# EAGLE design TinyFunctionGenerator (EAGLE 7.6.0)
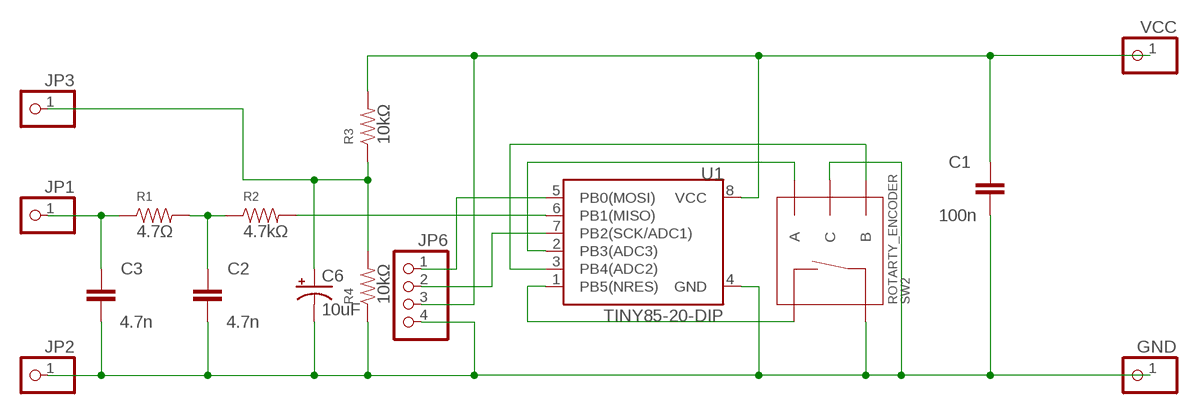
[diagram p0: schematic, sheet 1]

## Parts
C1  100n  CAP_  [AXIAL-5MM]
C2  4.7n  CAPPTH  [CAP-PTH-SMALL]
C3  4.7n  CAPPTH  [CAP-PTH-SMALL]
C6  10uF  10UF-25V-20%(PTH)  [CPOL-RADIAL-10UF-25V]
GND  PINHD-1X1CB  [1X01-CLEANBIG]
JP1  PINHD-1X1CB  [1X01-CLEANBIG]
JP2  PINHD-1X1CB  [1X01-CLEANBIG]
JP3  PINHD-1X1CB  [1X01-CLEANBIG]
JP6  HEADER-1X4ROUND  [1X04_ROUND]
R1  4.7Ω  RESISTORPTH-1/4W  [AXIAL-0.4]
R2  4.7kΩ  RESISTORPTH-1/4W  [AXIAL-0.4]
R3  10kΩ  RESISTORPTH-1/4W  [AXIAL-0.4]
R4  10kΩ  RESISTORPTH-1/4W  [AXIAL-0.4]
SW2  ROTARTY_ENCODER  [ROTARY_ENC_PLAIN]
U1  TINY85-20-DIP  ATTINY45TINY85-20-DIP  [DIP08]
VCC  PINHD-1X1CB  [1X01-CLEANBIG]

## Nets
GND: C1.P$2 C2.2 C3.2 C6.2(-) GND.1 JP2.1 JP6.4 R4.P$1 SW2.C SW2.SW+ U1.4(GND)
N$1: JP6.2 U1.7(PB2(SCK/ADC1))
N$2: JP6.1 U1.5(PB0(MOSI))
N$3: C2.1 R1.P$2 R2.P$1
N$4: R2.P$2 U1.6(PB1(MISO))
N$5: SW2.A U1.2(PB3(ADC3))
N$6: SW2.B U1.3(PB4(ADC2))
N$7: SW2.SW- U1.1(PB5(NRES))
N$8: C3.1 JP1.1 R1.P$1
N$9: C6.1(+) JP3.1 R3.P$1 R4.P$2
VCC: C1.P$1 JP6.3 R3.P$2 U1.8(VCC) VCC.1

## Library data of the parts
C1-C3 = SparkFun-Capacitors:CAP: Capacitor Standard 0603 ceramic capacitor, and 0.1" leaded capacitor.
C6 = SparkFun-Capacitors:10UF-25V-20%(PTH): CAP-08440; PROD_ID: CAP-08440
GND JP1-JP3 VCC = adafruit:PINHD-1X1: Pin header 1x1 for 0.1" spacing With round pins
JP6 = microbuilder:HEADER-1X4: PIN HEADER
R1-R4 = SparkFun-Resistors:RESISTOR: Resistor Basic schematic elements and footprints for 0603, 1206, and PTH resistors.
SW2 = SparkFun-Electromechanical:ROTARTY_ENCODER: Simple no LED rotary encoder Example: COM-09117
U1 = SparkFun-DigitalIC:ATTINY45: Atmel 8-pin 2/4/8kB flash uC; PROD_ID: IC-09445

## Board
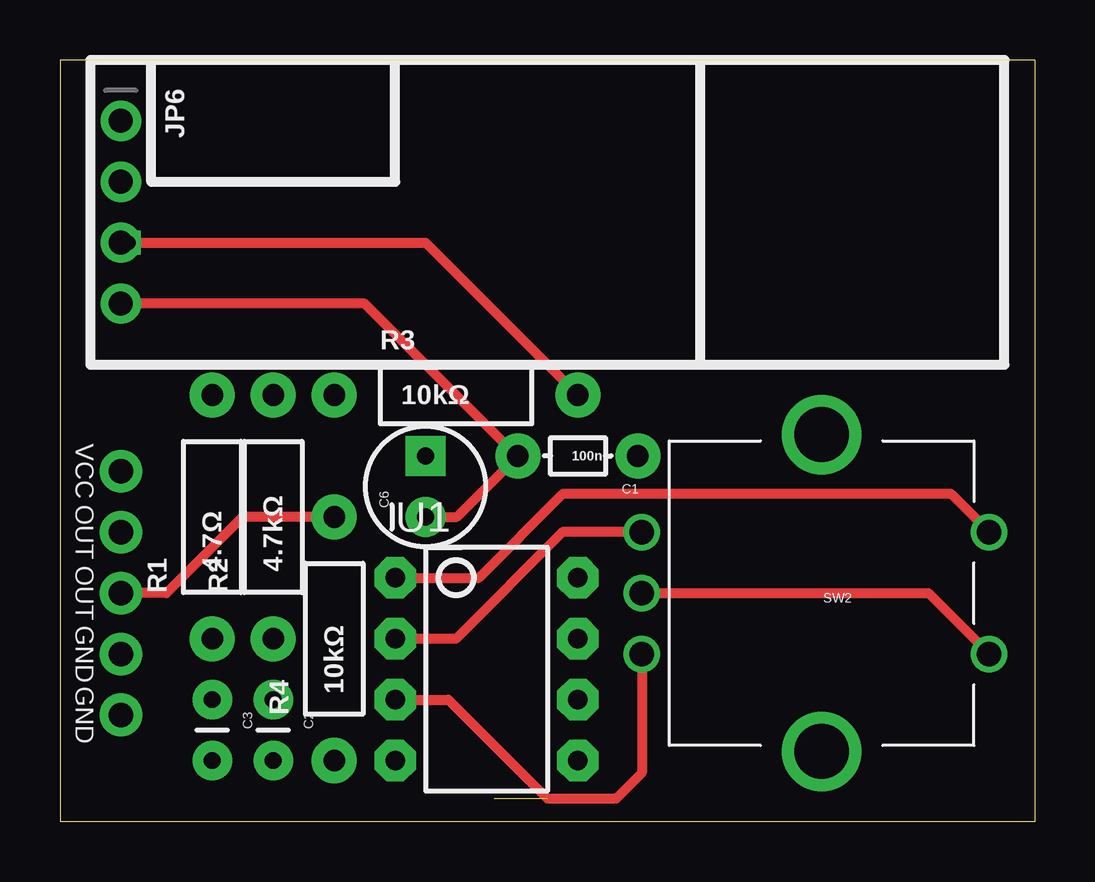
[diagram p1: board, top side]
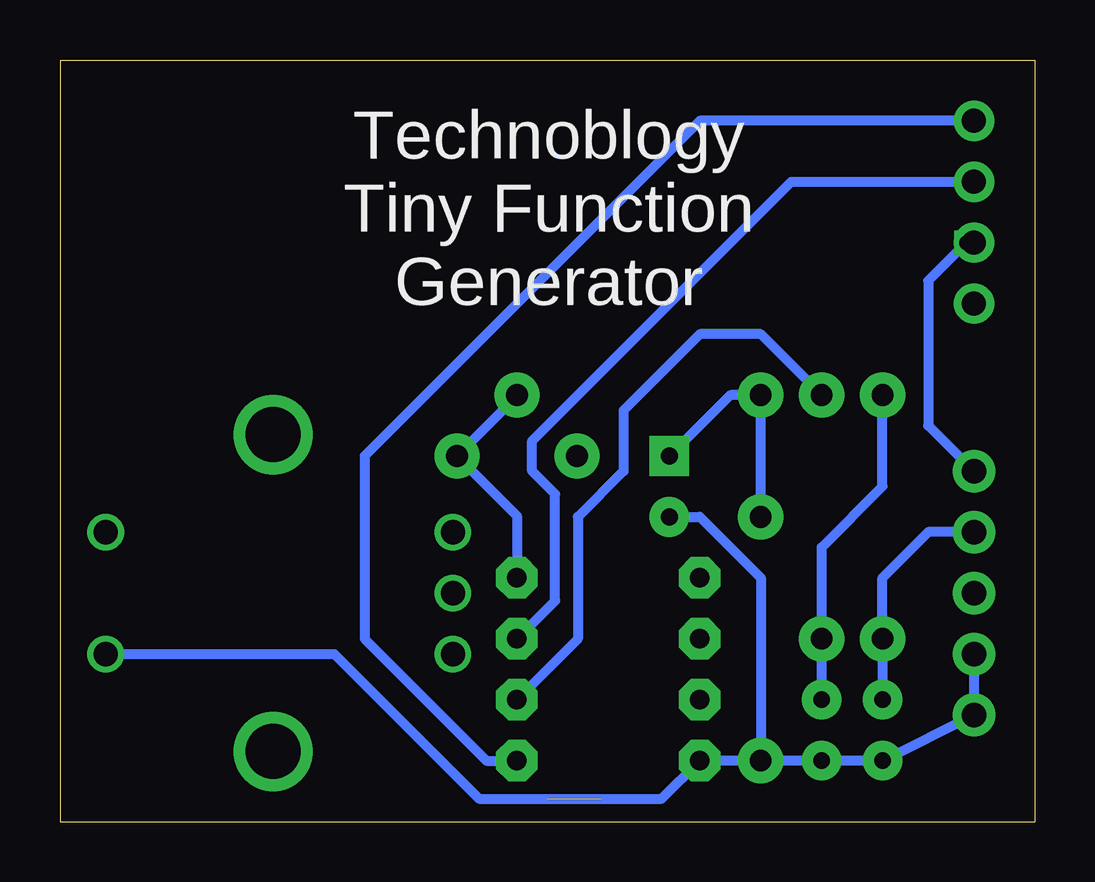
[diagram p2: board, bottom side, seen from below]

Size 40.64 x 31.75 mm. Coordinates in mm from the lower left corner, seen from the top.
Outline: 0,31.75 0,0 40.64,0 40.64,31.75 0,31.75
Copper layers (1*16): Top 0.035mm / dielectric 1.5mm / Bottom 0.035mm
Design rules "default *": minimum track width 10mil, minimum drill 24mil, track to track 8mil, track to pad 8mil, pad to pad 8mil, via to via 8mil, smd to smd 8mil, copper to edge 40mil, drill to drill 8mil, minimum pad ring 10mil, minimum via ring 8mil, stop-mask expansion 4mil, vias tented up to drill 20mil, thermal gap 10mil

### Footprints (pad centres in the part's own frame; a part is rotated, then mirrored left to right if it is on the bottom)
AXIAL-5MM = drill 0.9 pad 1.88: P$1 -2.5,0; P$2 2.5,0
CAP-PTH-SMALL = drill 0.7 pad 1.651: 1 0,0; 2 2.54,0
CPOL-RADIAL-10UF-25V = drill 0.7 pad 1.651 square: 1 1.27,0 | drill 0.7 pad 1.651: 2 -1.27,0
1X01-CLEANBIG = drill 1.016 pad 1.778: 1 0,0
1X04_ROUND = drill 1 pad 1.676: 1 -3.81,0; 2 -1.27,0; 3 1.27,0; 4 3.81,0
AXIAL-0.4 = drill 0.9 pad 1.88: P$1 -5.08,0; P$2 5.08,0
ROTARY_ENC_PLAIN = drill 1.016: A 7.493,-2.54; B 7.493,2.54; C 7.493,0; SW+ -6.985,2.54; SW- -6.985,-2.54 | drill 2.286: P$3 0,6.604; P$4 0,-6.604
DIP08 = drill 0.813 pad 1.727 octagon: 1 -3.81,-3.81; 2 -1.27,-3.81; 3 1.27,-3.81; 4 3.81,-3.81; 5 3.81,3.81; 6 1.27,3.81; 7 -1.27,3.81; 8 -3.81,3.81

### Placement (x,y rotation side)
C1  21.59,15.24 180 top
C2  8.89,5.08 270 top
C3  6.35,5.08 270 top
C6  15.24,13.97 90 top
GND  2.54,4.45 0 top
JP1  2.54,12.06 0 top
JP2  2.54,6.99 0 top
JP3  2.54,9.53 0 top
JP6  2.54,25.4 270 top
R1  6.35,12.7 90 top
R2  8.89,12.7 90 top
R3  16.51,17.78 0 top
R4  11.43,7.62 90 top
SW2  31.75,9.53 180 top
U1  17.78,6.35 270 top
VCC  2.54,14.61 0 top

### Tracks (layer width: path | path; a pad name or v marks a point on that pad's centre or on a via)
GND
  Top 0.406: C6.2 16.55,12.7 C1.P$2 19.05,15.24 12.7,21.59 JP6.4 | SW2.C 36.2,9.53 SW2.SW+
  Bottom 0.406: R4.P$1 C2.2 C3.2 GND.1 JP2.1 | R4.P$1 U1.4 15.56,0.95 23.18,0.95 29.21,6.99 SW2.SW+ | C6.2 13.97,12.7 11.43,10.16 R4.P$1
N$1
  Bottom 0.406: U1.7 20,9.21 20,13.65 20.95,14.61 20.95,15.88 10.16,26.67 JP6.2
N$2
  Bottom 0.406: JP6.1 13.97,29.21 27.94,15.24 27.94,7.62 22.86,2.54 U1.5
N$3
  Bottom 0.406: C2.1 R2.P$1 8.89,11.43 6.35,13.97 R1.P$2
N$4
  Bottom 0.406: U1.6 19.05,7.62 19.05,12.7 17.14,14.61 17.14,17.14 13.97,20.32 11.43,20.32 R2.P$2
N$5
  Top 0.406: SW2.A 20.95,12.06 16.51,7.62 U1.2
N$6  (1 unrouted)
  Top 0.406: SW2.B 24.26,2.03 23.18,0.95 20.32,0.95 16.19,5.08 U1.3
N$7
  Top 0.406: U1.1 17.46,10.16 20.95,13.65 37.15,13.65 SW2.SW-
N$8
  Bottom 0.406: C3.1 R1.P$1 6.35,10.16 4.44,12.06 JP1.1
N$9
  Top 0.406: R4.P$2 7.62,12.7 4.44,9.53 JP3.1
  Bottom 0.406: R4.P$2 R3.P$1 12.7,17.78 C6.1
VCC  (via drill 0.6)
  Top 0.406: v2.86,24.13 15.24,24.13 R3.P$2
  Bottom 0.406: JP6.3 v2.86,24.13 4.44,22.54 4.44,16.51 VCC.1 | U1.8 21.59,12.74 C1.P$1 21.59,17.74 R3.P$2

### Text on the board
tPlace: VCC | OUT | OUT | GND | GND
bPlace: Technoblogy / Tiny Function / Generator